# Altium schematic sheet MIXR Power - Battery Charging.SchDoc: Title
size B; Organization: Midnight Sun Solar Rayce Car Team; Address1: University of Waterloo; Address2: 200 University Ave W; Address3: Waterloo, ON, Canada; Address4: N2L 3E9; DocumentNumber: 3; SheetNumber: 3; SheetTotal: 5; Website: www.uwmidsun.com; ProjectName: ProjectName
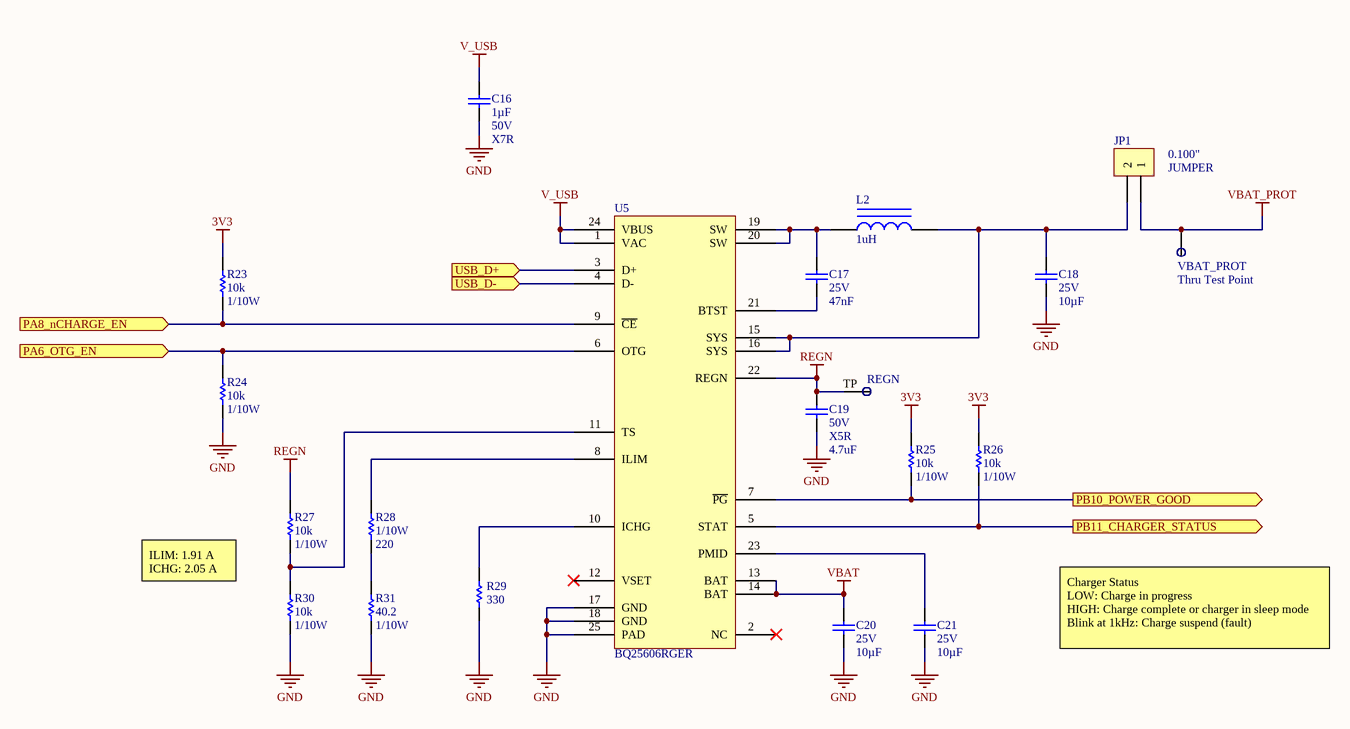
[diagram p0: MIXR Power - Battery Charging.SchDoc]

## Parts
C16  Capacitance: 1µF  Voltage: 50V  Temperature Coefficient: X7R  [CAP, 0603]  (hidden comment: CAP CER 1UF 50V 10% X7R 0603)
C17  Voltage: 25V  Capacitance: 47nF  [CAP, 0603]  (hidden comment: CAP CER 0.047UF 10% 25V X7R 0603)
C18  Voltage - Rated: 25V  Capacitance: 10µF  [CAP, 0805]  (hidden comment: CAP CER 10uF 25V 10% X5R 0805)
C19  value 4.7uF  Voltage - Rated: 50V  Temperature Coefficient: X5R  [CAP, 0805]  (hidden comment: CAP CER 4.7UF 50V 10% X5R 0805)
C20  Voltage - Rated: 25V  Capacitance: 10µF  [CAP, 0805]  (hidden comment: CAP CER 10uF 25V 10% X5R 0805)
C21  Voltage - Rated: 25V  Capacitance: 10µF  [CAP, 0805]  (hidden comment: CAP CER 10uF 25V 10% X5R 0805)
JP1  Row Spacing - Mating: 0.100"  [CONN, 2POS JUMPER 0.1"]  (hidden comment: JUMPER)
L2  Inductance: 1uH  [IND 1uH 3.8A 25 MOHM SMD]  (hidden comment: IND 1uH 3.8A 25 MOHM SMD)
R23  Resistance: 10k  Power: 1/10W  [RES, 0603]  (hidden comment: RES 10K OHM 1% 1/10W 0603)
R24  Resistance: 10k  Power: 1/10W  [RES, 0603]  (hidden comment: RES 10K OHM 1% 1/10W 0603)
R25  Resistance: 10k  Power: 1/10W  [RES, 0603]  (hidden comment: RES 10K OHM 1% 1/10W 0603)
R26  Resistance: 10k  Power: 1/10W  [RES, 0603]  (hidden comment: RES 10K OHM 1% 1/10W 0603)
R27  Resistance: 10k  Power: 1/10W  [RES, 0603]  (hidden comment: RES 10K OHM 1% 1/10W 0603)
R28  Power (Watts): 1/10W  Resistance: 220  [RES, 0603]  (hidden comment: RES 220 OHM 1% 1/10W 0603)
R29  value 330  [RES, 0603]  (hidden comment: RES 330 OHM 1% 1/10W 0603)
R30  Resistance: 10k  Power: 1/10W  [RES, 0603]  (hidden comment: RES 10K OHM 1% 1/10W 0603)
R31  Resistance: 40.2  Power: 1/10W  [RES, 0603]  (hidden comment: RES 40.2 OHM 0.5% 1/10W 0603)
REGN  Test Point  [Test Point]  (value not drawn)  (no BOM)
U5  Manufacturer Part Number: BQ25606RGER  [IC BATT CHG LI-ION 1 CELL 24-VQFN]  (hidden comment: IC BATT CHG LI-ION 1 CELL 24-VQFN)
VBAT_PROT  Thru Test Point  [Thru Test Point]

## Ports
PA6_OTG_EN (in), PA8_nCHARGE_EN (in), PB10_POWER_GOOD (out), PB11_CHARGER_STATUS (out), USB_D+ (in), USB_D- (in)

## Nets
3V3: R23.1 R25.1 R26.1
GND: C16.2 C18.2 C19.2 C20.2 C21.2 R24.2 R29.2 R30.2 R31.2 U5.17(GND) U5.18(GND) U5.25(PAD)
REGN: C19.1 R27.1 REGN.TP U5.22(REGN)
V_USB: C16.1 U5.1(VAC) U5.24(VBUS)
VBAT: C20.1 U5.13(BAT) U5.14(BAT)
VBAT_PROT: JP1.1 VBAT_PROT.TH_TP
PA6_OTG_EN: R24.1 U5.6(OTG) ; port PA6_OTG_EN
PA8_nCHARGE_EN: R23.2 U5.9(~{CE}) ; port PA8_nCHARGE_EN
PB10_POWER_GOOD: R25.2 U5.7(~{PG}) ; port PB10_POWER_GOOD
PB11_CHARGER_STATUS: R26.2 U5.5(STAT) ; port PB11_CHARGER_STATUS
USB_D+: U5.3(D+) ; port USB_D+
USB_D-: U5.4(D-) ; port USB_D-
NetC17_1: C17.1 L2.1 U5.19(SW) U5.20(SW)
NetC17_2: C17.2 U5.21(BTST)
NetC18_1: C18.1 JP1.2 L2.2 U5.15(SYS) U5.16(SYS)
NetC21_1: C21.1 U5.23(PMID)
NetR27_2: R27.2 R30.1 U5.11(TS)
NetR28_1: R28.1 U5.8(ILIM)
NetR28_2: R28.2 R31.1
NetR29_1: R29.1 U5.10(ICHG)

Not connected (* = marked no-connect by the designer): U5 2(NC)* 12(VSET)*

## Notes on the sheet
- ILIM: 1.91 A
  ICHG: 2.05 A
- Charger Status
  LOW: Charge in progress
  HIGH: Charge complete or charger in sleep mode
  Blink at 1kHz: Charge suspend (fault)
- PROJECT
- DOCUMENT
- DRAWN BY
- LAST MODIFIED
- PART NUMBER
- REVISION
- SHEET
- VARIANT
- OF

## Library data of the parts
C16 = CAP CER 1UF 50V 10% X7R 0603: 1µF ±10% 50V Ceramic Capacitor X7R 0603 (1608 Metric); Manufacturer 1: Taiyo Yuden; Manufacturer Part Number 1: UMK107AB7105KA-T; Supplier 1: Digi-Key; Supplier Part Number 1: 587-3247-1-ND; Packaging: Cut Tape (CT); Part Status: Active; Operating Temperature: -55°C ~ 125°C; Ratings: -; Mounting Type: Surface Mount, MLCC; Package / Case: 0603 (1608 Metric); Size / Dimension: 0.063" L x 0.031" W (1.60mm x 0.80mm); Height - Seated (Max): -; Thickness (Max): 0.037" (0.95mm); Lead Spacing: -; Lead Style: -; ComponentLink1URL: http://www.yuden.co.jp/productdata/catalog/en/mlcc_all_e.pdf; ComponentLink1Description: http://www.yuden.co.jp/productdata/catalog/en/mlcc_all_e.pdf; Tolerance: ±10%
C17 = CAP CER 0.047UF 10% 25V X7R 0603: 0.047µF ±10% 25V Ceramic Capacitor X7R 0603 (1608 Metric) /; Manufacturer: KEMET; Manufacturer Part Number: C0603C473K3RACTU; Supplier 1: Digi-Key; Supplier Part Number 1: 399-7931-1-ND; Stock 1: 1163581; Pricing 1: 1 = 0.11000, 10 = 0.07800, 100 = 0.03650, 500 = 0.02562, 1000 = 0.02121 (USD); RoHS: Yes; Mount: Surface Mount; Case/Package: 0603; Dielectric Material: Ceramic; Contact Plating: Tin; Min Operating Temperature: -55°C; Max Operating Temperature: 125°C; Tolerance: 10%; Packaging: Tape and Reel; Dielectric: X7R; Termination: SMD/SMT; Voltage Rating (DC): 25V; Length: 1.6mm; Height: 0.8mm; Depth: 0.8mm; Radiation Hardening: No; ComponentLink1URL: https://datasheet.ciiva.com/28682/1851736-28682293.pdf?src-supplier=Element14; ComponentLink1Description: https://datasheet.ciiva.com/28682/1851736-28682293.pdf?src-supplier=Element14; ComponentLink2URL: https://datasheet.ciiva.com/28584/1918693-28584138.pdf?src-supplier=Element14; ComponentLink2Description: https://datasheet.ciiva.com/28584/1918693-28584138.pdf?src-supplier=Element14; ComponentLink3URL: https://datasheet.ciiva.com/46445/1851736-46445227.pdf?src-supplier=Element14; ComponentLink3Description: https://datasheet.ciiva.com/46445/1851736-46445227.pdf?src-supplier=Element14; ComponentLink4URL: https://datasheet.ciiva.com/18193/getdatasheetpartid-330260-18193100.pdf?src-supplier=Verical; ComponentLink4Description: https://datasheet.ciiva.com/18193/getdatasheetpartid-330260-18193100.pdf?src-supplier=Verical; ComponentLink5URL: https://datasheet.ciiva.com/7824/kem-c1002-x7r-smd-7824045.pdf?src-supplier=Element14; ComponentLink5Description: https://datasheet.ciiva.com/7824/kem-c1002-x7r-smd-7824045.pdf?src-supplier=Element14
C18 C20 C21 = CAP CER 10uF 25V 10% X5R 0805: 10µF ±10% 25V Ceramic Capacitor X5R 0805 (2012 Metric); Manufacturer: Murata Electronics North America; Manufacturer Part Number: GRM21BR61E106KA73L; Supplier 1: Digi-Key; RoHS: RoHS Compliant; Category: Capacitors; Stock 1: 1695157; Packaging: Cut Tape (CT); Part Status: Active; Tolerance: ±10%; Temperature Coefficient: X5R; Operating Temperature: -55°C ~ 85°C; Features: -; Ratings: -; Applications: General Purpose; Mounting Type: Surface Mount, MLCC; Package / Case: 0805 (2012 Metric); Size / Dimension: 0.079" L x 0.049" W (2.00mm x 1.25mm); Height - Seated (Max): -; Thickness (Max): 0.053" (1.35mm); Lead Spacing: -; Lead Style: -; ComponentLink1URL: http://search.murata.co.jp/Ceramy/image/img/A01X/G101/ENG/GRM21BR61E106KA73-01.pdf; ComponentLink1Description: http://search.murata.co.jp/Ceramy/image/img/A01X/G101/ENG/GRM21BR61E106KA73-01.pdf; Supplier Part Number 1: 490-5523-1-ND; Pricing 1: 1=0.3, 10=0.214, 100=0.1008, 500=0.07068, 1000=0.05851 (CAD)
C19 = CAP CER 4.7UF 50V 10% X5R 0805: 4.7µF ±20% 50V Ceramic Capacitor X5R 0805 (2012 Metric); Manufacturer 1: Murata Electronics North America; Manufacturer Part Number 1: GRT21BR61H475ME13L; Description 1: CAP CER 4.7UF 50V X5R 0805; Supplier 1: Digi-Key; Supplier Part Number 1: 490-12395-1-ND; RoHS: RoHS Compliant; Category: Capacitors; Stock 1: 4286; Pricing 1: 1=0.56, 10=0.389, 100=0.2338, 500=0.17536, 1000=0.14808 (CAD); Packaging: Cut Tape (CT); Part Status: Active; Tolerance: ±20%; Operating Temperature: -55°C ~ 85°C; Features: -; Ratings: AEC-Q200; Applications: Automotive; Mounting Type: Surface Mount, MLCC; Package / Case: 0805 (2012 Metric); Size / Dimension: 0.079" L x 0.049" W (2.00mm x 1.25mm); Height - Seated (Max): -; Thickness (Max): 0.057" (1.45mm); Lead Spacing: -; Lead Style: -; ComponentLink1URL: http://search.murata.co.jp/Ceramy/image/img/A01X/G101/ENG/GRT21BR61H475ME13-01.pdf; ComponentLink1Description: http://search.murata.co.jp/Ceramy/image/img/A01X/G101/ENG/GRT21BR61H475ME13-01.pdf
JP1 = CONN 2POS JUMPER 0.1": 2 Positions Header Connector Through Hole Gold; Manufacturer: Omron Electronics Inc-EMC Div; Manufacturer Part Number: XG8T-0231; Style: Board to Board or Cable; Shrouding: Unshrouded; Number of Positions: 2; Number of Positions Loaded: All; Contact Length - Mating: 0.169" (4.30mm); Contact Length - Post: 0.118" (3.00mm); Overall Contact Length: 0.386" (9.80mm); Material Flammability Rating: UL94 V-0; Current Rating: 2A; Voltage Rating: 300V; Supplier 1: Digi-Key; RoHS: RoHS Compliant; Category: Connectors, Interconnects; Stock 1: 9094; Pricing 1: 1=0.28, 10=0.265, 100=0.183, 500=0.15484, 1000=0.12668, 5000=0.11261, 10000=0.10205 (CAD); Packaging: Bulk; Part Status: Active; Connector Type: Header; Contact Type: Male Pin; Pitch - Mating: -; Number of Rows: 2; Mounting Type: Through Hole; Termination: Solder; Fastening Type: -; Insulation Height: 0.098" (2.50mm); Contact Shape: Square; Contact Finish - Mating: Gold; Contact Finish Thickness - Mating: 5.9µin (0.15µm); Contact Finish - Post: Tin; Contact Material: Brass, Nickel; Insulation Material: Polybutylene Terephthalate (PBT), Glass Filled; Features: -; Operating Temperature: -55°C ~ 105°C; Ingress Protection: -; Insulation Color: Black; Mated Stacking Heights: -; Contact Finish Thickness - Post: -; Applications: -; ComponentLink1URL: http://www.omron.com/ecb/products/pdf/en-xj8.pdf; ComponentLink1Description: http://www.omron.com/ecb/products/pdf/en-xj8.pdf; Supplier Part Number 1: XG8T-0231-ND; Type: JUMPER
L2 = IND 1uH 3.8A 25 MOHM SMD: 1µH Shielded Inductor 3.8A 25mOhm Max Nonstandard /; Manufacturer: Vishay Dale; Manufacturer Part Number: IFSC1515AHER1R0M01; Tolerance: 20%; DC Resistance (DCR): 25mR; Test Frequency: 100kHz; Supplier 1: Digi-Key; Supplier Part Number 1: 541-1403-1-ND; Stock 1: 59210; Pricing 1: 1 = 0.64000, 10 = 0.55900, 100 = 0.39960, 500 = 0.33568, 1000 = 0.27175 (USD); RoHS: Yes; Mount: Surface Mount; Case/Package: 1515; Number of Pins: 2; Min Operating Temperature: -55°C; Max Operating Temperature: 125°C; Package Quantity: 2000; Current Rating: 3.8A; Saturation Current: 3.8A; Shielding: Shielded; Packaging: Tape and Reel; Inductance Tolerance: 20%; Max DC Current: 3.8A; Termination: SMD/SMT; RMS Current (Irms): 3.8A; Military Standard: Not; Length: 0.15inch; Height: 1.8mm; Width: 0.15inch; Height - Seated (Max): 0.075inch; Depth: 4mm; REACH SVHC: Unknown; Lead Free: Lead Free; ComponentLink1URL: https://datasheet.ciiva.com/1049/sc15ah01-1049408.pdf?src-supplier=Digi-Key; ComponentLink1Description: https://datasheet.ciiva.com/1049/sc15ah01-1049408.pdf?src-supplier=Digi-Key; ComponentLink2URL: https://datasheet.ciiva.com/1049/sc15ah01-1049409.pdf?src-supplier=Digi-Key; ComponentLink2Description: https://datasheet.ciiva.com/1049/sc15ah01-1049409.pdf?src-supplier=Digi-Key; ComponentLink3URL: https://datasheet.ciiva.com/3079/sc15ah01-3079157.pdf?src-supplier=Avnet; ComponentLink3Description: https://datasheet.ciiva.com/3079/sc15ah01-3079157.pdf?src-supplier=Avnet; ComponentLink4URL: https://datasheet.ciiva.com/1049/sc15ah01-1049407.pdf?src-supplier=Digi-Key; ComponentLink4Description: https://datasheet.ciiva.com/1049/sc15ah01-1049407.pdf?src-supplier=Digi-Key; ComponentLink5URL: https://datasheet.ciiva.com/8017/sc15ah01-8017535.pdf?src-supplier=Element14; ComponentLink5Description: https://datasheet.ciiva.com/8017/sc15ah01-8017535.pdf?src-supplier=Element14
R23-R27 R30 = RES 10K OHM 1% 1/10W 0603: RES SMD 10K OHM 1% 1/10W 0603; Manufacturer 1: Yageo; Manufacturer Part Number 1: RC0603FR-0710KL; Temperature Coefficient: ±100ppm/°C; Supplier 1: Digi-Key; Supplier Part Number 1: 311-10.0KHRCT-ND; Packaging: Cut Tape (CT); Part Status: Active; Composition: Thick Film; Operating Temperature: -55°C ~ 155°C; Package / Case: 0603 (1608 Metric); Supplier Device Package: 0603; Size / Dimension: 0.063" L x 0.031" W (1.60mm x 0.80mm); Height - Seated (Max): 0.022" (0.55mm); Failure Rate: -; ComponentLink1URL: http://www.yageo.com/documents/recent/PYu-RC_Group_51_RoHS_L_7.pdf; ComponentLink1Description: http://www.yageo.com/documents/recent/PYu-RC_Group_51_RoHS_L_7.pdf; Tolerance: ±1%
R28 = RES 220 OHM 1% 1/10W 0603: 220 Ohms ±1% 0.1W, 1/10W Chip Resistor 0603 (1608 Metric) Moisture Resistant Thick Film; Manufacturer: Yageo; Manufacturer Part Number: RC0603FR-07220RL; Temperature Coefficient: ±100ppm/°C; Supplier 1: Digi-Key; RoHS: RoHS Compliant; Category: Resistors; Stock 1: 1318812; Pricing 1: 1=0.15, 10=0.022, 100=0.0088, 1000=0.00392, 2500=0.0034 (CAD); Packaging: Cut Tape (CT); Part Status: Active; Tolerance: ±1%; Composition: Thick Film; Features: Moisture Resistant; Operating Temperature: -55°C ~ 155°C; Package / Case: 0603 (1608 Metric); Supplier Device Package: 0603; Size / Dimension: 0.063" L x 0.032" W (1.60mm x 0.80mm); Height - Seated (Max): 0.022" (0.55mm); Failure Rate: -; ComponentLink1URL: http://www.yageo.com/documents/recent/PYu-RC_Group_51_RoHS_L_8.pdf; ComponentLink1Description: http://www.yageo.com/documents/recent/PYu-RC_Group_51_RoHS_L_8.pdf; Supplier Part Number 1: 311-220HRCT-ND
R29 = RES 330 OHM 1% 1/10W 0603: 330 Ohms ±1% 0.1W, 1/10W Chip Resistor 0603 (1608 Metric) Automotive AEC-Q200, Moisture Resistant Thick Film; Manufacturer: TE Connectivity; Manufacturer Part Number: CRGCQ0603F330R; Supplier 1: Digi-Key; Supplier Part Number 1: A129682CT-ND; RoHS: No; Stock 1: 87700; Pricing 1: 1 = 0.10000, 10 = 0.03300, 100 = 0.01320, 1000 = 0.00595, 2500 = 0.00516 (USD); ComponentLink1URL: http://www.te.com/commerce/DocumentDelivery/DDEController?Action=srchrtrv&DocNm=1773204-3&DocType=DS&DocLang=English&src-supplier=Digi-Key; ComponentLink1Description: http://www.te.com/commerce/DocumentDelivery/DDEController?Action=srchrtrv&DocNm=1773204-3&DocType=DS&DocLang=English&src-supplier=Digi-Key; ComponentLink2URL: https://www.te.com/commerce/DocumentDelivery/DDEController?Action=srchrtrv&DocNm=1773204-3&DocType=DS&DocLang=English&src-supplier=Digi-Key; ComponentLink2Description: https://www.te.com/commerce/DocumentDelivery/DDEController?Action=srchrtrv&DocNm=1773204-3&DocType=DS&DocLang=English&src-supplier=Digi-Key
R31 = RES 40.2 OHM 0.5% 1/10W 0603: RES SMD 40.2 OHM 0.5% 1/10W 0603; Manufacturer 1: Yageo; Manufacturer Part Number 1: RT0603DRE0740R2L; Temperature Coefficient: ±50ppm/°C; Supplier 1: Digi-Key; Supplier Part Number 1: 311-2576-1-ND; Packaging: Cut Tape (CT); Part Status: Active; Composition: Thin Film; Operating Temperature: -55°C ~ 155°C; Package / Case: 0603 (1608 Metric); Supplier Device Package: 0603; Size / Dimension: 0.063" L x 0.031" W (1.60mm x 0.80mm); Height - Seated (Max): 0.022" (0.55mm); Failure Rate: -; ComponentLink1URL: http://www.yageo.com/documents/recent/PYu-RT_1-to-0.01_RoHS_L_7.pdf; ComponentLink1Description: http://www.yageo.com/documents/recent/PYu-RT_1-to-0.01_RoHS_L_7.pdf; Tolerance: ±0.5%
U5 = IC BATT CHG LI-ION 1 CELL 24-VQFN: Charger IC Lithium Ion/Polymer 24-VQFN (4x4); Manufacturer: Texas Instruments; Number of Cells: 1; Supplier 1: Digi-Key; Supplier Part Number 1: 296-47743-1-ND; Stock 1: 8983; Pricing 1: 1 = 2.76000, 10 = 2.48100, 100 = 2.03260, 500 = 1.73032, 1000 = 1.45930 (USD); RoHS: No; ComponentLink1URL: http://www.ti.com/lit/ds/symlink/bq25606.pdf?src-supplier=Digi-Key; ComponentLink1Description: http://www.ti.com/lit/ds/symlink/bq25606.pdf?src-supplier=Digi-Key